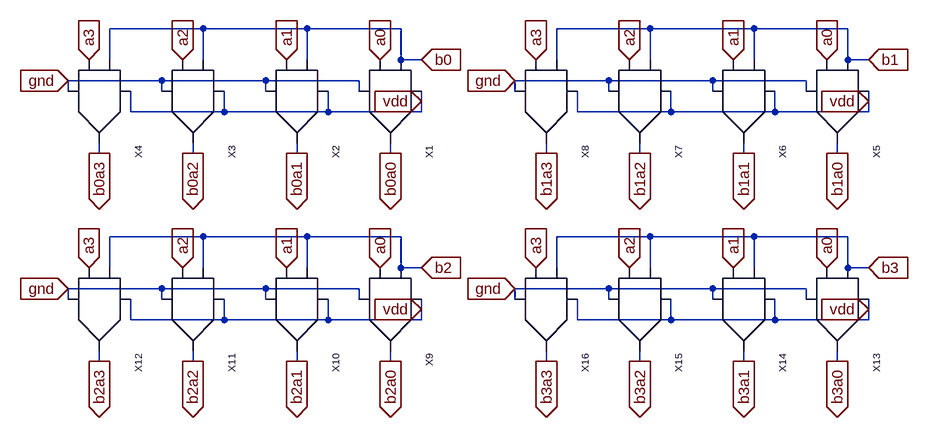
[diagram p0: schematic partial_product_generator.asc]
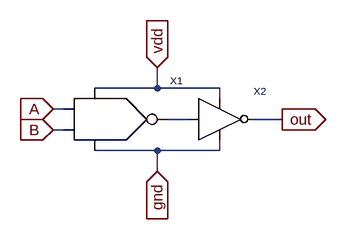
[diagram p1: sub-circuit and.asc]
partial_product_generator.asc, the LTspice schematic file:
Version 4.1
SHEET 1 880 680
WIRE -272 16 -416 16
WIRE -112 16 -272 16
WIRE 32 16 -112 16
WIRE 416 16 272 16
WIRE 576 16 416 16
WIRE 720 16 576 16
WIRE -416 64 -416 16
WIRE -272 64 -272 16
WIRE -112 64 -112 16
WIRE 32 64 32 16
WIRE 64 64 32 64
WIRE 272 64 272 16
WIRE 416 64 416 16
WIRE 576 64 576 16
WIRE 720 64 720 16
WIRE 752 64 720 64
WIRE -336 96 -480 96
WIRE -176 96 -336 96
WIRE -32 96 -176 96
WIRE 352 96 208 96
WIRE 512 96 352 96
WIRE 656 96 512 96
WIRE -480 112 -480 96
WIRE -336 112 -336 96
WIRE -176 112 -176 96
WIRE -32 112 -32 96
WIRE 208 112 208 96
WIRE 352 112 352 96
WIRE 512 112 512 96
WIRE 656 112 656 96
WIRE 64 128 64 112
WIRE 752 128 752 112
WIRE -384 144 -384 112
WIRE -240 144 -240 112
WIRE -240 144 -384 144
WIRE -80 144 -80 112
WIRE -80 144 -240 144
WIRE 64 144 64 128
WIRE 64 144 -80 144
WIRE 304 144 304 112
WIRE 448 144 448 112
WIRE 448 144 304 144
WIRE 608 144 608 112
WIRE 608 144 448 144
WIRE 752 144 752 128
WIRE 752 144 608 144
WIRE -432 208 -432 192
WIRE -288 208 -288 192
WIRE -128 208 -128 192
WIRE 16 208 16 192
WIRE 256 208 256 192
WIRE 400 208 400 192
WIRE 560 208 560 192
WIRE 704 208 704 192
WIRE -272 336 -416 336
WIRE -112 336 -272 336
WIRE 32 336 -112 336
WIRE 416 336 272 336
WIRE 576 336 416 336
WIRE 720 336 576 336
WIRE -416 384 -416 336
WIRE -272 384 -272 336
WIRE -112 384 -112 336
WIRE 32 384 32 336
WIRE 64 384 32 384
WIRE 272 384 272 336
WIRE 416 384 416 336
WIRE 576 384 576 336
WIRE 720 384 720 336
WIRE 752 384 720 384
WIRE -336 416 -480 416
WIRE -176 416 -336 416
WIRE -32 416 -176 416
WIRE 352 416 208 416
WIRE 512 416 352 416
WIRE 656 416 512 416
WIRE -480 432 -480 416
WIRE -336 432 -336 416
WIRE -176 432 -176 416
WIRE -32 432 -32 416
WIRE 208 432 208 416
WIRE 352 432 352 416
WIRE 512 432 512 416
WIRE 656 432 656 416
WIRE 64 448 64 432
WIRE 752 448 752 432
WIRE -384 464 -384 432
WIRE -240 464 -240 432
WIRE -240 464 -384 464
WIRE -80 464 -80 432
WIRE -80 464 -240 464
WIRE 64 464 64 448
WIRE 64 464 -80 464
WIRE 304 464 304 432
WIRE 448 464 448 432
WIRE 448 464 304 464
WIRE 608 464 608 432
WIRE 608 464 448 464
WIRE 752 464 752 448
WIRE 752 464 608 464
WIRE -432 528 -432 512
WIRE -288 528 -288 512
WIRE -128 528 -128 512
WIRE 16 528 16 512
WIRE 256 528 256 512
WIRE 400 528 400 512
WIRE 560 528 560 512
WIRE 704 528 704 512
FLAG -480 96 gnd
IOPIN -480 96 In
FLAG 64 128 vdd
IOPIN 64 128 In
FLAG 64 64 b0
IOPIN 64 64 In
FLAG -448 64 a3
IOPIN -448 64 In
FLAG -304 64 a2
IOPIN -304 64 In
FLAG -144 64 a1
IOPIN -144 64 In
FLAG 0 64 a0
IOPIN 0 64 In
FLAG 16 208 b0a0
IOPIN 16 208 Out
FLAG -128 208 b0a1
IOPIN -128 208 Out
FLAG -288 208 b0a2
IOPIN -288 208 Out
FLAG -432 208 b0a3
IOPIN -432 208 Out
FLAG 208 96 gnd
IOPIN 208 96 In
FLAG 752 128 vdd
IOPIN 752 128 In
FLAG 752 64 b1
IOPIN 752 64 In
FLAG 240 64 a3
IOPIN 240 64 In
FLAG 384 64 a2
IOPIN 384 64 In
FLAG 544 64 a1
IOPIN 544 64 In
FLAG 688 64 a0
IOPIN 688 64 In
FLAG 704 208 b1a0
IOPIN 704 208 Out
FLAG 560 208 b1a1
IOPIN 560 208 Out
FLAG 400 208 b1a2
IOPIN 400 208 Out
FLAG 256 208 b1a3
IOPIN 256 208 Out
FLAG -480 416 gnd
IOPIN -480 416 In
FLAG 64 448 vdd
IOPIN 64 448 In
FLAG 64 384 b2
IOPIN 64 384 In
FLAG -448 384 a3
IOPIN -448 384 In
FLAG -304 384 a2
IOPIN -304 384 In
FLAG -144 384 a1
IOPIN -144 384 In
FLAG 0 384 a0
IOPIN 0 384 In
FLAG 16 528 b2a0
IOPIN 16 528 Out
FLAG -128 528 b2a1
IOPIN -128 528 Out
FLAG -288 528 b2a2
IOPIN -288 528 Out
FLAG -432 528 b2a3
IOPIN -432 528 Out
FLAG 208 416 gnd
IOPIN 208 416 In
FLAG 752 448 vdd
IOPIN 752 448 In
FLAG 752 384 b3
IOPIN 752 384 In
FLAG 240 384 a3
IOPIN 240 384 In
FLAG 384 384 a2
IOPIN 384 384 In
FLAG 544 384 a1
IOPIN 544 384 In
FLAG 688 384 a0
IOPIN 688 384 In
FLAG 704 528 b3a0
IOPIN 704 528 Out
FLAG 560 528 b3a1
IOPIN 560 528 Out
FLAG 400 528 b3a2
IOPIN 400 528 Out
FLAG 256 528 b3a3
IOPIN 256 528 Out
SYMBOL and 16 112 R90
SYMATTR InstName X1
SYMBOL and -128 112 R90
SYMATTR InstName X2
SYMBOL and -288 112 R90
SYMATTR InstName X3
SYMBOL and -432 112 R90
SYMATTR InstName X4
SYMBOL and 704 112 R90
SYMATTR InstName X5
SYMBOL and 560 112 R90
SYMATTR InstName X6
SYMBOL and 400 112 R90
SYMATTR InstName X7
SYMBOL and 256 112 R90
SYMATTR InstName X8
SYMBOL and 16 432 R90
SYMATTR InstName X9
SYMBOL and -128 432 R90
SYMATTR InstName X10
SYMBOL and -288 432 R90
SYMATTR InstName X11
SYMBOL and -432 432 R90
SYMATTR InstName X12
SYMBOL and 704 432 R90
SYMATTR InstName X13
SYMBOL and 560 432 R90
SYMATTR InstName X14
SYMBOL and 400 432 R90
SYMATTR InstName X15
SYMBOL and 256 432 R90
SYMATTR InstName X16

and.asc, the sub-circuit schematic file:
Version 4.1
SHEET 1 880 680
WIRE 304 112 304 80
WIRE 304 112 208 112
WIRE 400 112 304 112
WIRE 400 128 400 112
WIRE 160 144 144 144
WIRE 352 160 320 160
WIRE 496 160 448 160
WIRE 160 176 144 176
WIRE 304 208 208 208
WIRE 400 208 400 192
WIRE 400 208 304 208
WIRE 304 240 304 208
FLAG 144 144 A
IOPIN 144 144 In
FLAG 144 176 B
IOPIN 144 176 In
FLAG 304 80 vdd
IOPIN 304 80 In
FLAG 304 240 gnd
IOPIN 304 240 In
FLAG 496 160 out
IOPIN 496 160 Out
SYMBOL nand 208 160 R0
SYMATTR InstName X1
SYMBOL inv 400 160 R0
SYMATTR InstName X2

The netlist it stands for:
* partial_product_generator.asc
X§X1 vdd b0 a0 gnd b0a0 and
X§X2 vdd b0 a1 gnd b0a1 and
X§X3 vdd b0 a2 gnd b0a2 and
X§X4 vdd b0 a3 gnd b0a3 and
X§X5 vdd b1 a0 gnd b1a0 and
X§X6 vdd b1 a1 gnd b1a1 and
X§X7 vdd b1 a2 gnd b1a2 and
X§X8 vdd b1 a3 gnd b1a3 and
X§X9 vdd b2 a0 gnd b2a0 and
X§X10 vdd b2 a1 gnd b2a1 and
X§X11 vdd b2 a2 gnd b2a2 and
X§X12 vdd b2 a3 gnd b2a3 and
X§X13 vdd b3 a0 gnd b3a0 and
X§X14 vdd b3 a1 gnd b3a1 and
X§X15 vdd b3 a2 gnd b3a2 and
X§X16 vdd b3 a3 gnd b3a3 and

* block symbol definitions
.subckt and vdd A B gnd out
X§X1 A B N001 vdd gnd nand  ; pins A B out vdd gnd
X§X2 out N001 vdd gnd inv  ; pins out in vdd gnd
.ends and

.backanno
.end